# EAGLE design dilip (EAGLE 7.7.0)
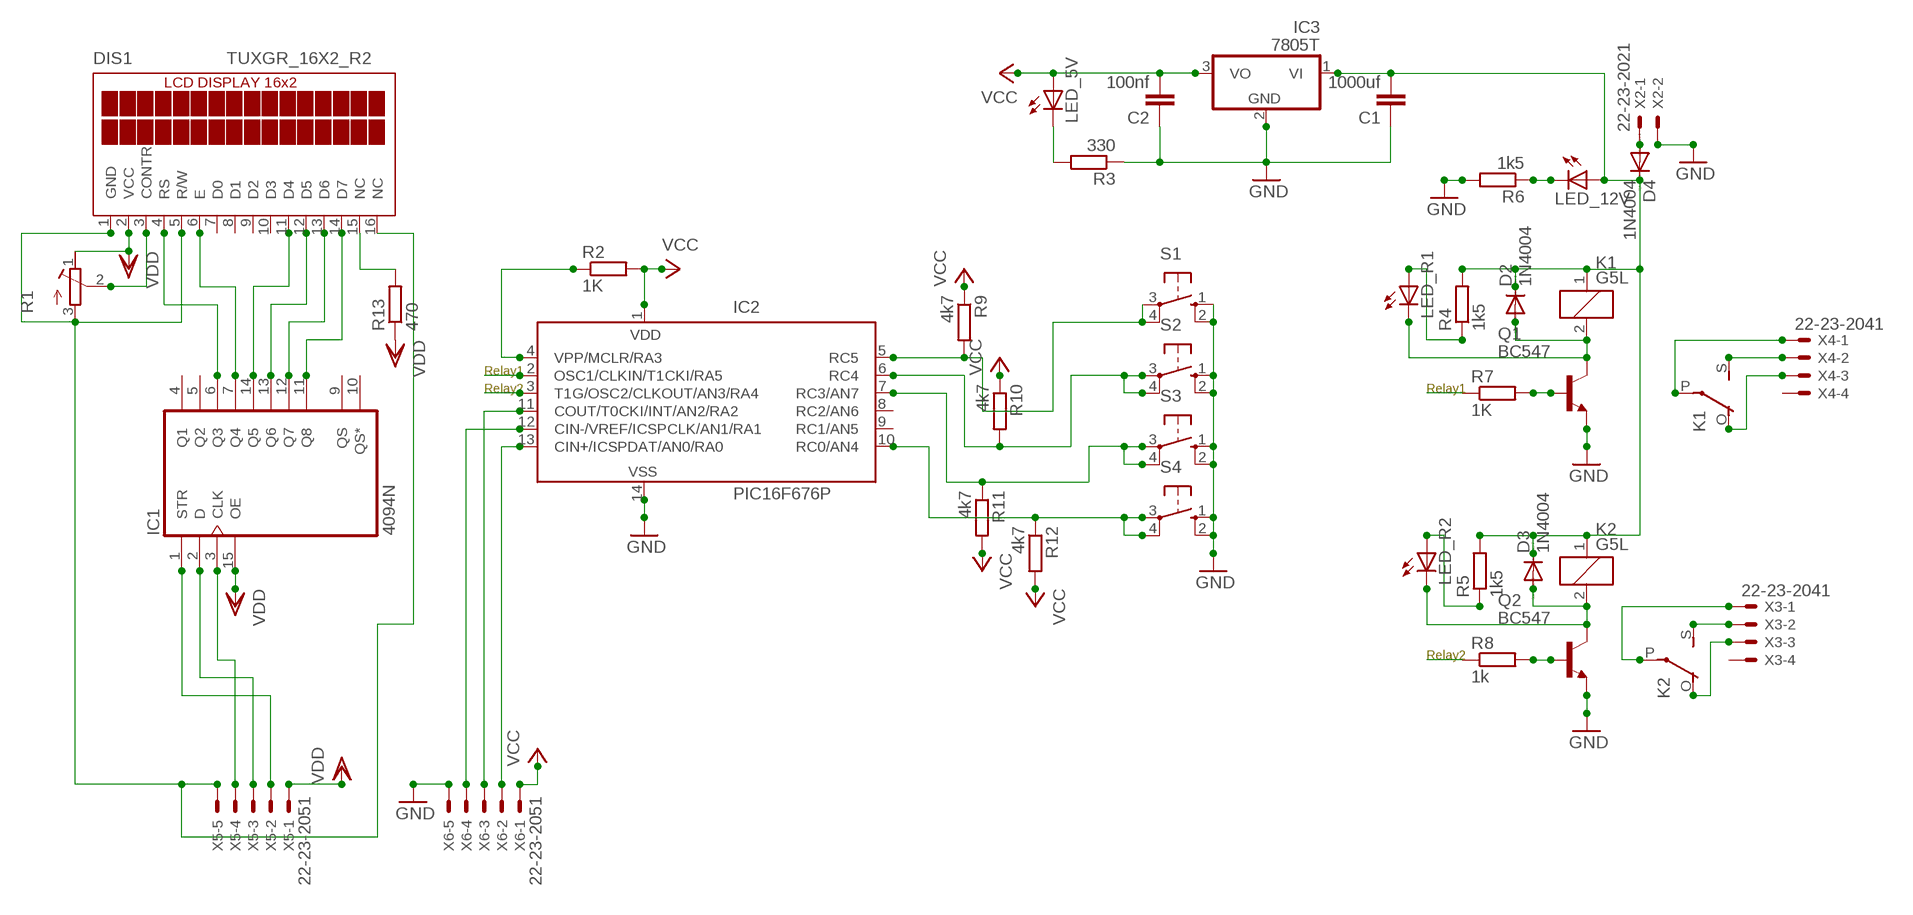
[diagram p0: schematic, sheet 1]

## Parts
C1  1000uf  C2.5/6  [C2.5-6]
C2  100nf  C2.5/6  [C2.5-6]
D2  1N4004  [DO41-10]
D3  1N4004  [DO41-10]
D4  1N4004  [DO41-10]
DIS1  TUXGR_16X2_R2  [TUXGR_16X2_R2]
IC1  4094N  [DIL16]
IC2  PIC16F676P  [DIL14]
IC3  7805T  [TO220H]
K1  G5L  [G5LE]
K2  G5L  [G5LE]
LED_5V  LED3MM  [LED3MM]
LED_12V  LED3MM  [LED3MM]
LED_R1  LED3MM  [LED3MM]
LED_R2  LED3MM  [LED3MM]
Q1  BC547  BC548  [TO92-EBC]
Q2  BC547  BC548  [TO92-EBC]
R1  R-TRIMMT93YA  [RTRIMT93YA]
R2  1K  R-EU_0207/10  [0207/10]
R3  330  R-EU_0207/10  [0207/10]
R4  1k5  R-EU_0207/10  [0207/10]
R5  1k5  R-EU_0207/10  [0207/10]
R6  1k5  R-EU_0207/10  [0207/10]
R7  1K  R-EU_0207/10  [0207/10]
R8  1k  R-EU_0207/10  [0207/10]
R9  4k7  R-EU_0207/10  [0207/10]
R10  4k7  R-EU_0207/10  [0207/10]
R11  4k7  R-EU_0207/10  [0207/10]
R12  4k7  R-EU_0207/10  [0207/10]
R13  470  R-EU_0207/10  [0207/10]
S1  40-XX  [B3F-40XX]
S2  40-XX  [B3F-40XX]
S3  40-XX  [B3F-40XX]
S4  40-XX  [B3F-40XX]
X2  22-23-2021  [22-23-2021]
X3  22-23-2041  [22-23-2041]
X4  22-23-2041  [22-23-2041]
X5  22-23-2051  [22-23-2051]
X6  22-23-2051  [22-23-2051]

## Nets
E: DIS1.6(E) IC1.7(Q4)
GND: C1.1 C2.1 IC2.14(VSS) IC3.2(GND) Q1.E Q2.E R3.1 R6.2 S1.1(S) S1.2(S1) S2.1(S) S2.2(S1) S3.1(S) S3.2(S1) S4.1(S) S4.2(S1) X2.2 X6.5
N$1: DIS1.3(CONTR) R1.2(S)
N$2: DIS1.11(D4) IC1.14(Q5)
N$3: DIS1.12(D5) IC1.13(Q6)
N$4: DIS1.13(D6) IC1.12(Q7)
N$5: DIS1.14(D7) IC1.11(Q8)
N$6: IC2.11(COUT/T0CKI/INT/AN2/RA2) X6.3
N$7: IC2.13(CIN+/ICSPDAT/AN0/RA0) X6.2
N$8: IC2.12(CIN-/VREF/ICSPCLK/AN1/RA1) X6.4
N$9: IC2.4(VPP/MCLR/RA3) R2.1
N$10: Q1.B R7.2
N$11: D2.A K1.2 LED_R1.K(C) Q1.C
N$12: D3.A K2.2 LED_R2.K(C) Q2.C
N$13: Q2.B R8.2
N$15: K2.P(2:P) X3.1
N$16: K2.S(2:S) X3.2
N$17: K2.O(2:O) X3.3
N$18: K1.S(2:S) X4.2
N$19: K1.P(2:P) X4.1
N$20: K1.O(2:O) X4.3
N$21: D4.A X2.1
N$22: LED_5V.K(C) R3.2
N$23: LED_R2.A R5.1
N$25: IC2.6(RC4) R10.2 S2.3(P) S2.4(P1)
N$26: LED_R1.A R4.1
N$27: IC2.7(RC3/AN7) R11.1 S3.3(P) S3.4(P1)
N$28: IC2.10(RC0/AN4) R12.1 S4.3(P) S4.4(P1)
N$30: LED_12V.K(C) R6.1
N$31: IC1.3(CLK) X5.4
N$32: IC1.2(D) X5.3
N$33: IC1.1(STR) X5.2
N$34: IC2.5(RC5) R9.2 S1.3(P) S1.4(P1)
N$35: DIS1.15(NC) R13.2
N$37: C1.2 D2.C D3.C D4.C IC3.1(VI) K1.1 K2.1 LED_12V.A R4.2 R5.2
RELAY1: IC2.2(OSC1/CLKIN/T1CKI/RA5) R7.1
RELAY2: IC2.3(T1G/OSC2/CLKOUT/AN3/RA4) R8.1
RS: DIS1.4(RS) IC1.6(Q3)
VCC: C2.2 IC2.1(VDD) IC3.3(VO) LED_5V.A R2.2 R9.1 R10.1 R11.2 R12.2 X6.1
VDD: DIS1.2(VCC) IC1.15(OE) R1.1(E) R13.1 X5.1
VSS: DIS1.1(GND) DIS1.5(R/W) DIS1.16(NC) R1.3(A) X5.5
Unconnected: DIS1.7(D0) DIS1.8(D1) DIS1.9(D2) DIS1.10(D3) IC1.4(Q1) IC1.5(Q2) IC1.9(QS) IC1.10(QS*) IC2.8(RC2/AN6) IC2.9(RC1/AN5) X3.4 X4.4

## Notes on the sheet
- Relay1
- Relay2 | Relay1
- Relay2

## Power pins joined to a net without a drawn wire
VDD: IC1.16(VDD)
VSS: IC1.8(VSS)

## Library data of the parts
C1 C2 = capacitor-wima:C: CAPACITOR naming: grid - package width
D2-D4 = diode:1N4004: DIODE general purpose rectifier, 1 A
DIS1 = display-lcd:TUXGR_16X2_R2: Tuxgraphics LCD display 16x2 characters reflective, without background light Source: tuxgr_12x2_r2.pdf; OC_FARNELL: unknown; OC_NEWARK: unknown
IC1 = 40xx:4094: 8-stage SHIFT/STORE REGISTER, tri-state
IC2 = microchip:PIC16F676: 14-Pin, Flash-Based 8-Bit CMOS Microcontroller High Performance RISC CPU: * Only 35 instructions to learn - All single-cycle instructions except branches * Operating speed: - DC - 20 MHz oscillator/clock input - DC - 200 ns instruction cycle * Internal and external oscillator options - Precision Internal 4 MHz oscillator factory calibrated to ±1% - External Oscillator support for crystals and resonators - 5?s wake-up from SLEEP, 3.0V, typical * Power saving SLEEP mode * Wide operating voltage range - 2.0V to 5.5V * Industrial and Extended temperature range * Low power Power-on Reset (POR) * Power-up Timer (PWRT) and Oscillator Start-up Timer (OST) * Brown-out Detect (BOD) * Watchdog Timer (WDT) with independent oscillator for reliable operation * Multiplexed MCLR/Input-pin * Interrupt-on-pin change * Individual programmable weak pull-ups * Programmable code protection * High Endurance FLASH/EEPROM Cell - 100,000 write FLASH endurance - 1,000,000 write EEPROM endurance - FLASH/Data EEPROM Retention: > 40 years * Standby Current: - 1 nA @ 2.0V, typical * Operating Current: - 8.5?A @ 32 kHz, 2.0V, typical - 100?A @ 1 MHz, 2.0V, typical * Watchdog Timer Current - 300 nA @ 2.0V, typical * Timer1 oscillator current: - 4?A @ 32 kHz, 2.0V, typical * 12 I/O pins with individual direction control * High current sink/source for direct LED drive * Analog-to-Digital Converter module (PIC16F676): - 10-bit resolution - Programmable 8-channel input - Voltage reference input * In-Circuit Serial ProgrammingTM (ICSPTM) via two pins Source: http://ww1.microchip.com/downloads/en/DeviceDoc/40039E.pdf; MF: MICROCHIP; MPN: PIC16F676-I/P; OC_FARNELL: 9760512; OC_NEWARK: 54K2829
IC3 = linear:78*: Positive VOLTAGE REGULATOR Source: http://cache.national.com/ds/LM/LM78L05.pdf http://www.fairchildsemi.com/ds/LM/LM7805.pdf
K1 K2 = relay:G5L: RELAY 1 x switch, 10 A/120 V AC, 8 A/30 V ADC, Omron; OC_FARNELL: unknown; OC_NEWARK: unknown
LED_5V LED_12V LED_R1 LED_R2 = led:LED: LED OSRAM: - CHIPLED LG R971, LG N971, LY N971, LG Q971, LY Q971, LO R971, LY R971 LH N974, LH R974 LS Q976, LO Q976, LY Q976 LO Q996 - Hyper CHIPLED LW Q18S LB Q993, LB Q99A, LB R99A - SideLED LS A670, LO A670, LY A670, LG A670, LP A670 LB A673, LV A673, LT A673, LW A673 LH A674 LY A675 LS A676, LA A676, LO A676, LY A676, LW A676 LS A679, LY A679, LG A679 - Hyper Micro SIDELED® LS Y876, LA Y876, LO Y876, LY Y876 LT Y87S - SmartLED LW L88C, LW L88S LB L89C, LB L89S, LG L890 LS L89K, LO L89K, LY L89K LS L896, LA L896, LO L896, LY L896 - TOPLED LS T670, LO T670, LY T670, LG T670, LP T670 LSG T670, LSP T670, LSY T670, LOP T670, LYG T670 LG T671, LOG T671, LSG T671 LB T673, LV T673, LT T673, LW T673 LH T674 LS T676, LA T676, LO T676, LY T676, LB T676, LH T676, LSB T676, LW T676 LB T67C, LV T67C, LT T67C, LS T67K, LO T67K, LY T67K, LW E67C LS E67B, LA E67B, LO E67B, LY E67B, LB E67C, LV E67C, LT E67C LW T67C LS T679, LY T679, LG T679 LS T770, LO T770, LY T770, LG T770, LP T770 LB T773, LV T773, LT T773, LW T773 LH T774 LS E675, LA E675, LY E675, LS T675 LS T776, LA T776, LO T776, LY T776, LB T776 LHGB T686 LT T68C, LB T68C - Hyper Mini TOPLED® LB M676 - Mini TOPLED Santana® LG M470 LS M47K, LO M47K, LY M47K Source: http://www.osram.convergy.de LUXEON: - LUMILED® LXK2-PW12-R00, LXK2-PW12-S00, LXK2-PW14-U00, LXK2-PW14-V00 LXK2-PM12-R00, LXK2-PM12-S00, LXK2-PM14-U00 LXK2-PE12-Q00, LXK2-PE12-R00, LXK2-PE12-S00, LXK2-PE14-T00, LXK2-PE14-U00 LXK2-PB12-K00, LXK2-PB12-L00, LXK2-PB12-M00, LXK2-PB14-N00, LXK2-PB14-P00, LXK2-PB14-Q00 LXK2-PR12-L00, LXK2-PR12-M00, LXK2-PR14-Q00, LXK2-PR14-R00 LXK2-PD12-Q00, LXK2-PD12-R00, LXK2-PD12-S00 LXK2-PH12-R00, LXK2-PH12-S00 LXK2-PL12-P00, LXK2-PL12-Q00, LXK2-PL12-R00 Source: www.luxeon.com KINGBRIGHT: KA-3528ASYC Source: www.kingbright.com
Q1 Q2 = transistor-npn:BC548*: NPN Transistor
R1 = rcl:R-TRIMM: Trimm resistor
R2-R13 = resistor:R-EU_: RESISTOR, European symbol
S1-S4 = switch-omron:40-XX: OMRON SWITCH; MF: OMRON COMPONENTS USA; MPN: B3F-4000; OC_FARNELL: 176434; OC_NEWARK: 36K3105
X2 = con-molex:22-23-2021: .100" (2.54mm) Center Header - 2 Pin; MF: MOLEX; MPN: 22-23-2021; OC_FARNELL: 1462926; OC_NEWARK: 25C3832
X3 X4 = con-molex:22-23-2041: .100" (2.54mm) Center Header - 4 Pin; MF: MOLEX; MPN: 22-23-2041; OC_FARNELL: 1462920; OC_NEWARK: 38C0355
X5 X6 = con-molex:22-23-2051: .100" (2.54mm) Center Header - 5 Pin; MF: MOLEX; MPN: 22-23-2051; OC_FARNELL: 1462952; OC_NEWARK: 38C9178

## Board
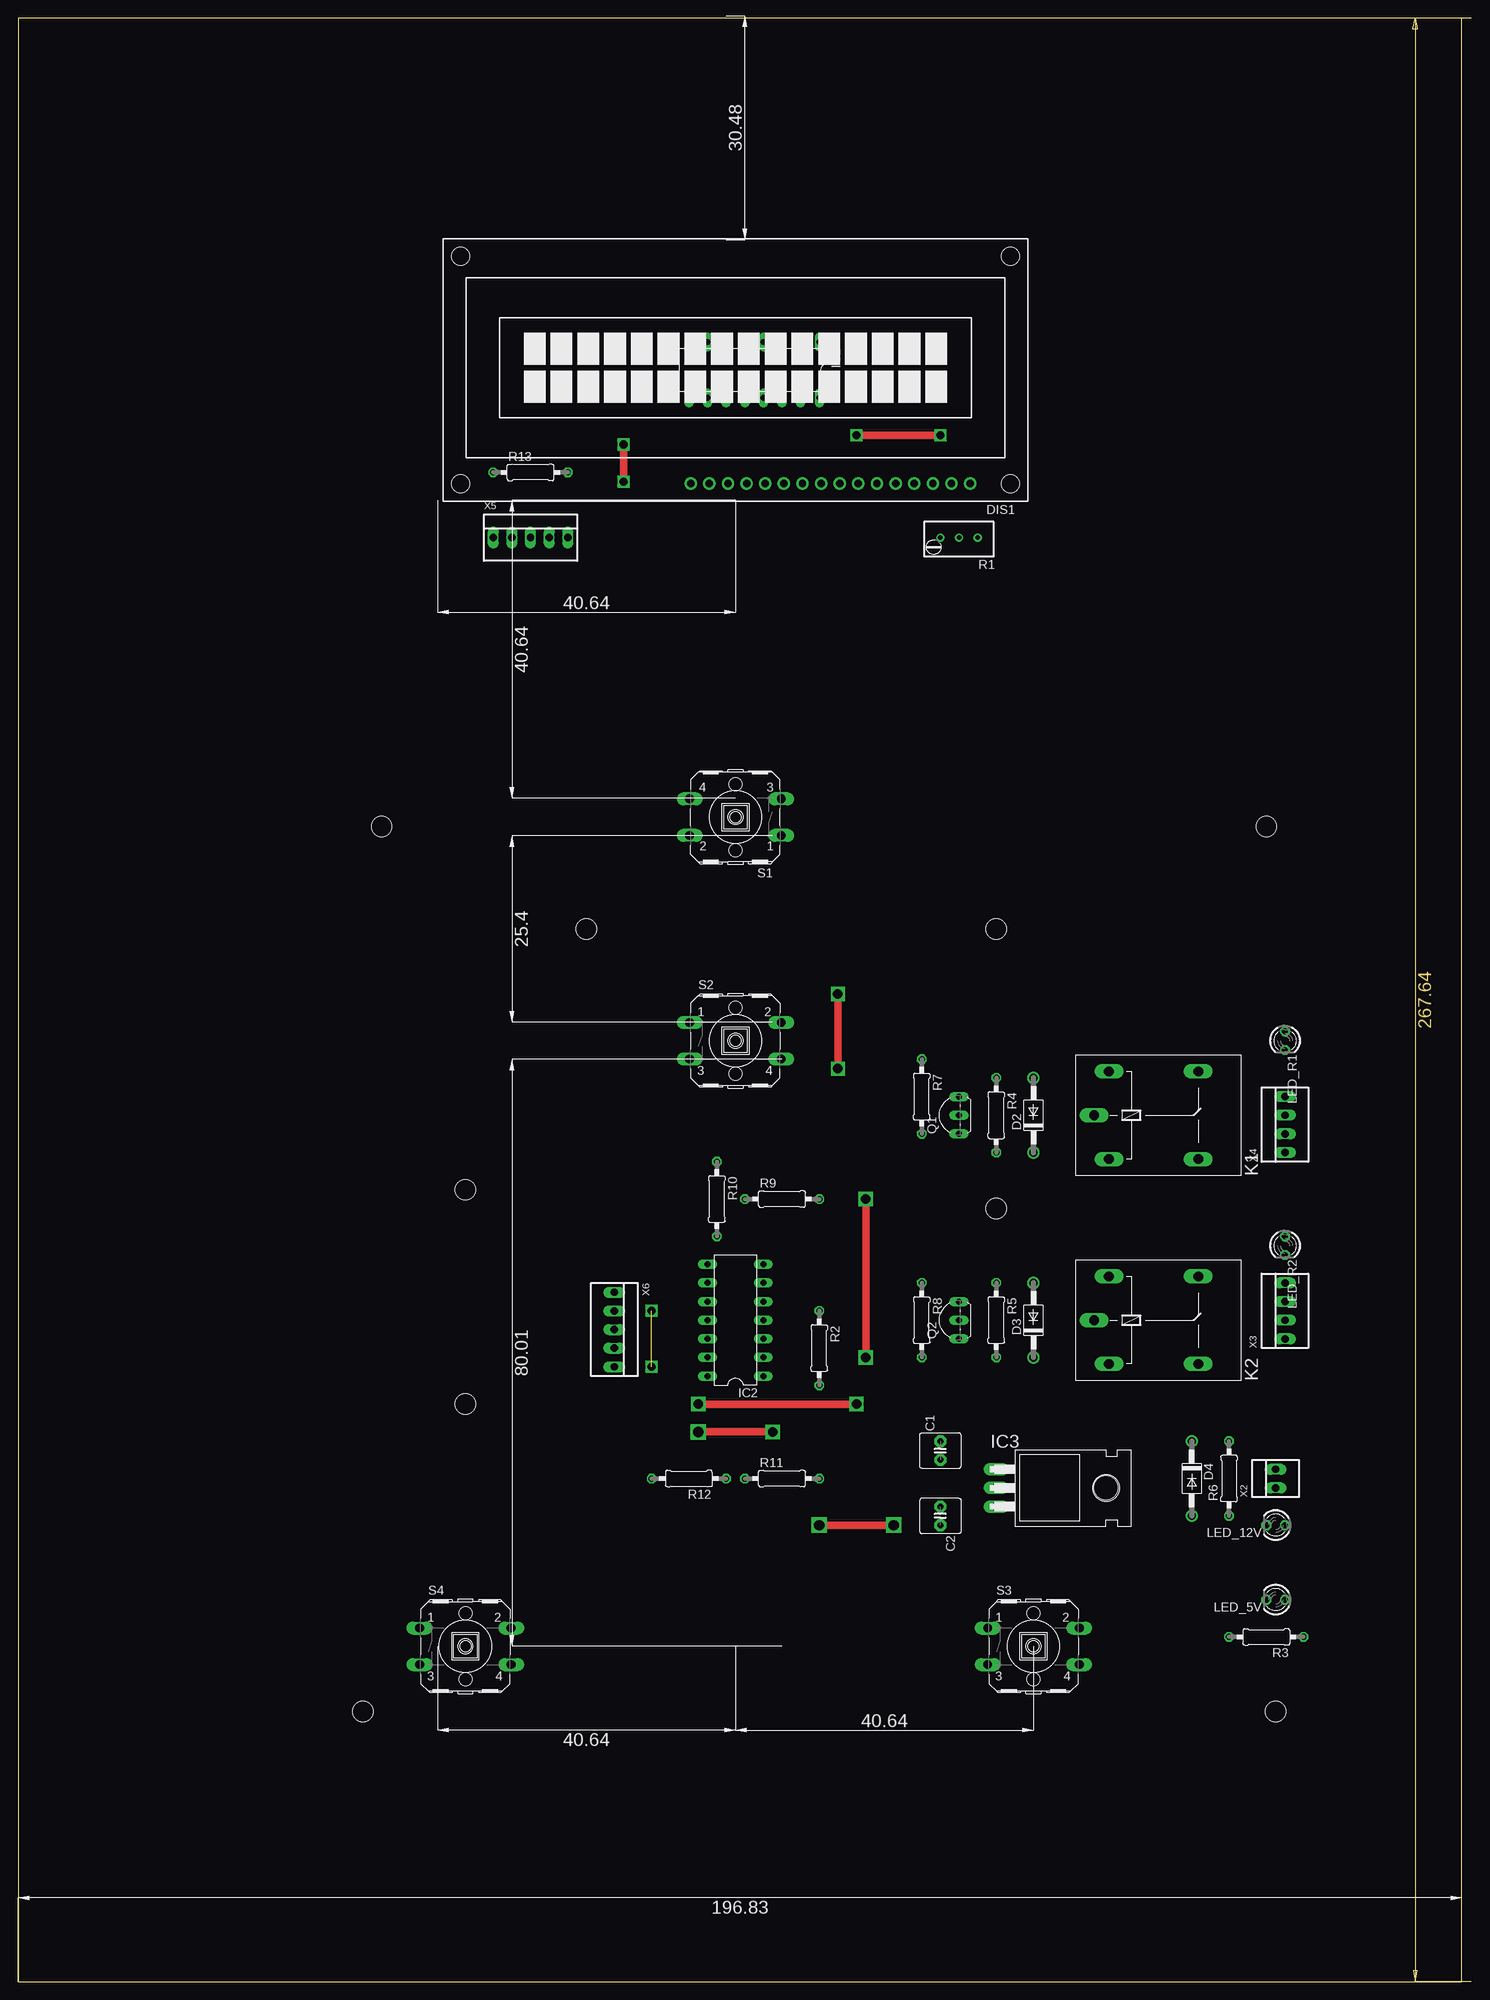
[diagram p1: board, top side]
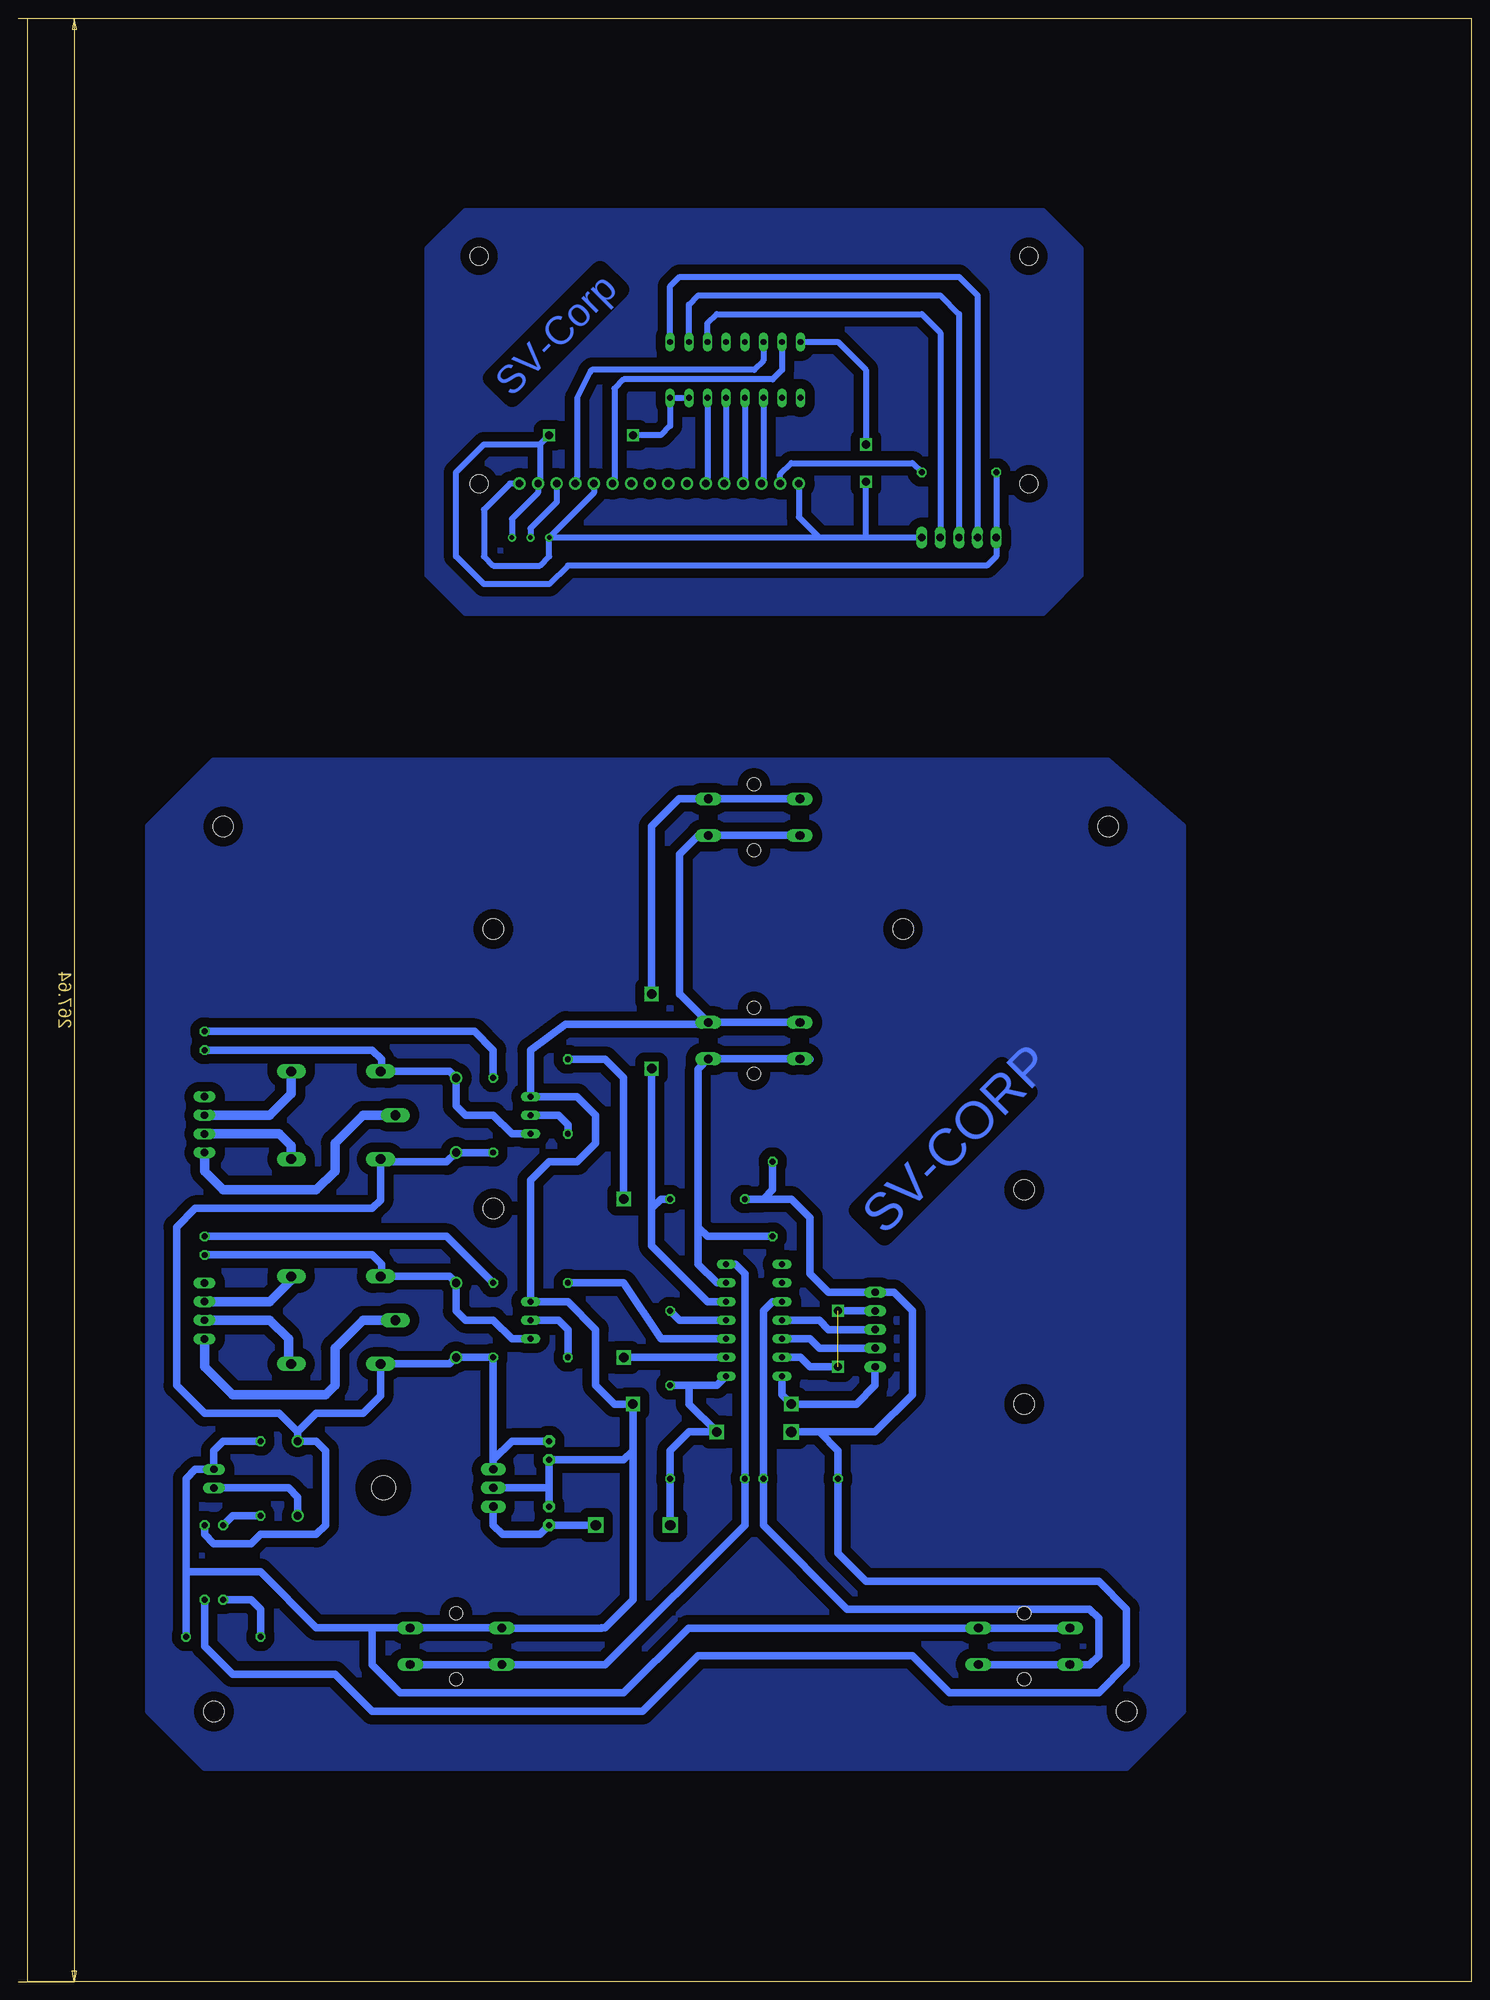
[diagram p2: board, bottom side, seen from below]

Size 196.83 x 267.64 mm. Coordinates in mm from the lower left corner, seen from the top.
Outline: 0,0 196.83,0 196.83,267.64 0,267.64 0,0
Copper layers (1*16): Top 0.035mm / dielectric 1.5mm / Bottom 0.035mm
Design rules "default": minimum track width 10mil, minimum drill 24mil, track to track 8mil, track to pad 8mil, pad to pad 8mil, via to via 8mil, smd to smd 8mil, copper to edge 40mil, drill to drill 8mil, minimum pad ring 10mil, minimum via ring 8mil, stop-mask expansion 4mil, vias tented up to drill 0mil, thermal gap 10mil
Holes 2.8 mm at 46.99,36.83 171.45,36.83 49.53,157.48 170.18,157.48 133.35,143.51 77.47,143.51 60.96,107.95 133.35,105.41 60.96,78.74

### Footprints (pad centres in the part's own frame; a part is rotated, then mirrored left to right if it is on the bottom)
C2.5-6 = drill 0.813 pad 1.6 octagon: 1 -1.27,0; 2 1.27,0
DO41-10 = drill 1.118: A 5.08,0; C -5.08,0
TUXGR_16X2_R2 = drill 1 pad 1.676: 1 -32,15.5; 2 -29.46,15.5; 3 -26.92,15.5; 4 -24.38,15.5; 5 -21.84,15.5; 6 -19.3,15.5; 7 -16.76,15.5; 8 -14.22,15.5; 9 -11.68,15.5; 10 -9.14,15.5; 11 -6.6,15.5; 12 -4.06,15.5; 13 -1.52,15.5; 14 1.02,15.5; 15 3.56,15.5; 16 6.1,15.5 | hole 2.5: -37.5,-15.5; 37.5,-15.5; -37.5,15.5; 37.5,15.5
DIL16 = drill 0.813 long: 1 -8.89,-3.81; 2 -6.35,-3.81; 3 -3.81,-3.81; 4 -1.27,-3.81; 5 1.27,-3.81; 6 3.81,-3.81; 7 6.35,-3.81; 8 8.89,-3.81; 9 8.89,3.81; 10 6.35,3.81; 11 3.81,3.81; 12 1.27,3.81; 13 -1.27,3.81; 14 -3.81,3.81; 15 -6.35,3.81; 16 -8.89,3.81
DIL14 = drill 0.813 long: 1 -7.62,-3.81; 2 -5.08,-3.81; 3 -2.54,-3.81; 4 0,-3.81; 5 2.54,-3.81; 6 5.08,-3.81; 7 7.62,-3.81; 8 7.62,3.81; 9 5.08,3.81; 10 2.54,3.81; 11 0,3.81; 12 -2.54,3.81; 13 -5.08,3.81; 14 -7.62,3.81
TO220H = drill 1.118 long: 1 -2.54,-10.16; 2 0,-10.16; 3 2.54,-10.16 | hole 3.302: 0,4.826
G5LE = drill 1.321 long: 1 -7.493,-5.969; 2 -7.493,5.969; O 4.699,5.969; P -9.525,0; S 4.699,-5.969
LED3MM = drill 0.813 octagon: A -1.27,0; K 1.27,0
TO92-EBC = drill 0.813 long: B 0,-1.27; C -2.54,-1.27; E 2.54,-1.27
RTRIMT93YA = drill 0.61: 1 0,-2.54; 2 0,0; 3 0,2.54
0207/10 = drill 0.813 octagon: 1 -5.08,0; 2 5.08,0
B3F-40XX = drill 1.194 long: 1 -6.248,2.489; 2 6.248,2.489; 3 -6.248,-2.489; 4 6.248,-2.489 | hole 1.803: 0,-4.496; 0,4.496
22-23-2021 = drill 1 long: 1 -1.27,0; 2 1.27,0
22-23-2041 = drill 1 long: 1 -3.81,0; 2 -1.27,0; 3 1.27,0; 4 3.81,0
22-23-2051 = drill 1 long: 1 -5.08,0; 2 -2.54,0; 3 0,0; 4 2.54,0; 5 5.08,0

### Placement (x,y rotation side)
C1  125.73,72.39 90 top
C2  125.73,63.5 270 top
D2  138.43,118.11 90 top
D3  138.43,90.17 90 top
D4  160.02,68.58 270 top
DIS1  97.79,219.71 180 top
IC1  100.33,219.71 180 top
IC2  97.79,90.17 90 top
IC3  143.51,67.31 270 top
K1  156.21,118.11 0 top
K2  156.21,90.17 0 top
LED_5V  171.45,52.07 180 top
LED_12V  171.45,62.23 180 top
LED_R1  172.72,128.27 270 top
LED_R2  172.72,100.33 270 top
Q1  127,118.11 90 top
Q2  127,90.17 90 top
R1  128.27,196.85 90 top
R2  109.22,86.36 270 top
R3  170.18,46.99 180 top
R4  133.35,118.11 270 top
R5  133.35,90.17 270 top
R6  165.1,68.58 90 top
R7  123.19,120.65 270 top
R8  123.19,90.17 270 top
R9  104.14,106.68 0 top
R10  95.25,106.68 270 top
R11  104.14,68.58 0 top
R12  91.44,68.58 180 top
R13  69.85,205.74 0 top
S1  97.79,158.75 180 top
S2  97.79,128.27 0 top
S3  138.43,45.72 0 top
S4  60.96,45.72 0 top
X2  171.45,68.58 90 top
X3  172.72,91.44 90 top
X4  172.72,116.84 90 top
X5  69.85,196.85 0 top
X6  81.28,88.9 270 top

### Tracks (layer width: path | path; a pad name or v marks a point on that pad's centre or on a via)
E
  Bottom 0.813: IC1.7 93.98,219.71 95.25,218.44 115.57,218.44 116.84,217.17 116.84,204.46 DIS1.6
GND  (via drill 1.3)
  Top 1.016: v114.3,78.74 v92.71,78.74
  Bottom 1.016: X6.5 81.28,81.28 83.82,78.74 v92.71,78.74 93.98,80.01 IC2.14 | R3.1 175.26,55.88 | 175.26,55.88 175.26,68.58 173.99,69.85 X2.2 171.45,72.39 170.18,73.66 R6.2 | 114.3,72.39 114.3,52.07 118.11,48.26 118.57,48.26 118.62,48.21 S3.1 132.23,48.26 144.73,48.26 | 114.3,72.39 v114.3,78.74 116.84,78.74 119.38,81.28 119.38,88.9 123.19,92.71 Q2.E 128.27,109.22 125.73,111.76 121.92,111.76 119.38,114.3 119.38,118.11 121.92,120.65 Q1.E 128.27,127 123.47,130.53 104.27,130.53 S2.2 | S1.2 S1.1 105.36,156.26 107.95,153.67 107.95,134.62 107.9,134.62 S2.2 | S2.2 S2.1 | 144.73,48.26 S3.2 | 149.86,48.26 149.86,43.18 146.05,39.37 115.57,39.37 106.73,48.21 S4.2 S4.1 | 144.73,48.26 149.86,48.26 | 125.73,67.31 C1.1 115.57,71.12 114.3,72.39 | 125.73,67.31 C2.1 | IC3.2 125.73,67.31 | 149.86,48.26 157.48,48.26 165.1,55.88 175.26,55.88
N$1
  Bottom 0.813: DIS1.3 124.71,201.68 128.27,198.12 R1.2
N$2
  Bottom 0.813: IC1.14 104.14,204.46 DIS1.11
N$3
  Bottom 0.813: IC1.13 101.6,204.46 DIS1.12
N$4
  Bottom 0.813: IC1.12 99.06,204.46 DIS1.13
N$5
  Bottom 0.813: IC1.11 96.52,204.46 DIS1.14
N$6
  Bottom 1.016: X6.3 87.63,88.9 88.9,90.17 IC2.11
N$7  (via drill 1.1)  (1 unrouted)
  Bottom 1.016: X6.2 v86.36,91.44 | IC2.13 91.44,85.09 90.17,83.82 v86.36,83.82
N$8
  Bottom 1.016: X6.4 88.9,86.36 90.17,87.63 IC2.12
N$9
  Bottom 1.016: IC2.4 107.95,90.17 R2.1
N$10
  Bottom 1.016: Q1.B 124.46,118.11 123.19,116.84 R7.2
N$11
  Bottom 1.016: Q1.C 130.81,115.57 133.35,118.11 137.16,118.11 138.43,119.38 D2.A 139.32,124.08 K1.2 148.59,124.21 148.59,125.73 149.86,127 LED_R1.K
N$12
  Bottom 1.016: Q2.C 130.81,87.63 133.35,90.17 137.16,90.17 138.43,91.44 D3.A 139.32,96.14 K2.2 148.59,96.27 148.59,97.79 149.86,99.06 LED_R2.K
N$13
  Bottom 1.016: Q2.B 124.46,90.17 123.19,88.9 R8.2
N$14
  pour Bottom (isolate 1.27): 58.42,241.3 137.16,241.3 142.24,236.22 142.24,191.77 137.16,186.69 58.42,186.69 53.34,191.77 53.34,236.22
N$15
  Bottom 1.27: K2.P 151.13,90.17 154.94,86.36 154.94,81.28 156.21,80.01 168.91,80.01 172.72,83.82 X3.1
N$16
  Bottom 1.27: X3.2 163.83,90.17 161.29,87.63 161.29,84.58 K2.S
N$17
  Bottom 1.27: K2.O 160.91,95.63 163.83,92.71 X3.3
N$18
  Bottom 1.27: K1.S 160.91,113.92 162.56,115.57 X4.2
N$19
  Bottom 1.27: K1.P 151.13,118.11 154.94,114.3 154.94,110.49 157.48,107.95 170.18,107.95 172.72,110.49 X4.1
N$20
  Bottom 1.27: X4.3 163.83,118.11 160.91,121.03 K1.O
N$21
  Bottom 1.016: X2.1 161.29,67.31 160.02,66.04 D4.A
N$22
  Bottom 1.016: LED_5V.K 166.37,52.07 165.1,50.8 R3.2
N$23
  Bottom 1.016: R5.1 139.7,101.6 LED_R2.A
N$24
  pour Bottom (isolate 1.27): 49.53,166.37 171.45,166.37 180.34,157.48 180.34,36.83 172.72,29.21 46.99,29.21 39.37,36.83 39.37,157.48
N$25
  Bottom 1.016: IC2.6 102.87,95.25 105.41,97.79 105.41,102.87 | 105.41,102.87 105.41,124.41 S2.4 S2.3 91.49,125.73 90.17,125.73 | R10.2 104.14,101.6 105.41,102.87
N$26
  Bottom 1.016: R4.1 133.35,127 135.89,129.54 LED_R1.A
N$27
  Bottom 1.016: IC2.7 100.33,97.79 99.06,96.52 R11.1 99.06,62.23 118.11,43.18 132.13,43.18 S3.3 S3.4
N$28
  Bottom 1.016: IC2.10 95.25,92.71 96.52,91.44 R12.1 96.52,62.23 85.09,50.8 52.07,50.8 50.8,49.53 50.8,44.45 52.07,43.18 54.66,43.18 S4.3 | S4.3 54.66,43.23 | S4.3 S4.4
N$30
  Bottom 1.016: LED_12V.K 168.91,63.5 R6.1
N$31
  Bottom 0.813: IC1.3 104.14,226.06 102.87,227.33 74.93,227.33 72.39,224.79 X5.4
N$32
  Bottom 0.813: IC1.2 106.68,228.6 105.41,229.87 72.39,229.87 69.85,227.33 X5.3
N$33
  Bottom 0.813: IC1.1 109.22,231.14 107.95,232.41 69.85,232.41 67.31,229.87 X5.2
N$34  (via drill 1.1, 1.3)
  Top 1.016: v111.76,134.62 v111.76,124.46
  Bottom 0.813: 91.49,161.29 S1.4
  Bottom 1.016: IC2.5 104.14,92.71 111.76,100.33 111.76,105.41 | 111.76,105.41 v111.76,124.46 | v111.76,134.62 111.76,157.48 108,161.24 S1.3 S1.4 | R9.2 110.49,106.68 111.76,105.41
N$35
  Bottom 0.813: DIS1.15 94.23,205.49 92.71,207.01 76.2,207.01 R13.2
N$37
  Bottom 1.016: R4.2 D2.C 139.7,111.76 148.34,111.76 K1.1 148.72,106.55 149.86,105.41 173.99,105.41 176.53,102.87 176.53,81.28 172.72,77.47 162.56,77.47 160.02,74.93 | 160.02,74.93 D4.C 157.48,73.66 156.21,72.39 156.21,62.23 157.48,60.96 165.1,60.96 166.37,59.69 171.45,59.69 172.72,60.96 LED_12V.A | 160.02,74.93 157.48,77.47 151.13,77.47 148.72,79.88 K2.1 139.32,84.2 D3.C R5.2 133.35,71.12 | 133.35,71.12 IC3.1 | C1.2 130.81,73.66 133.35,71.12
RELAY1  (via drill 1.3)
  Top 1.016: v115.57,106.68 v115.57,85.09
  Bottom 1.016: R7.1 118.11,125.73 115.57,123.19 v115.57,106.68 | IC2.2 v115.57,85.09
RELAY2
  Bottom 1.016: R8.1 115.57,95.25 110.49,87.63 IC2.3
RS
  Bottom 0.813: IC1.6 96.52,220.98 97.79,219.71 119.89,219.71 120.14,219.46 121.92,215.9 121.92,205.23 DIS1.4
VCC  (via drill 1.3, 1.4, 1.4 pad 1.27)
  Top 1.016: v92.71,74.93 v102.87,74.93 | v109.22,62.23 v119.38,62.23
  Bottom 1.016: 88.9,74.93 81.28,74.93 76.2,80.01 76.2,91.44 78.74,93.98 X6.1 87.63,93.98 90.17,96.52 90.17,104.14 92.71,106.68 96.52,106.68 | 88.9,74.93 v92.71,74.93 | IC2.1 102.87,81.28 106.68,81.28 | 106.68,81.28 R2.2 | 106.68,81.28 106.68,78.74 v102.87,74.93 106.68,74.93 109.22,72.39 R11.2 v109.22,62.23 | 88.9,74.93 86.36,72.39 R12.2 86.36,58.42 82.55,54.61 50.8,54.61 46.99,50.8 46.99,43.18 50.8,39.37 71.12,39.37 76.2,44.45 105.41,44.45 113.03,36.83 149.86,36.83 154.94,41.91 168.91,41.91 172.72,45.72 LED_5V.A | R9.1 96.52,106.68 | 96.52,106.68 95.25,107.95 R10.1 | IC3.3 133.35,62.23 132.08,60.96 127,60.96 C2.2 v119.38,62.23
VDD  (via drill 1.1)
  Top 1.016: v114.3,210.82 v125.73,210.82
  Bottom 0.813: IC1.15 IC1.16 109.22,212.09 110.49,210.82 v114.3,210.82 | R1.1 130.81,199.39 127.25,202.95 DIS1.2 127,204.46 127,209.55 | 127,209.55 v125.73,210.82 | 127,209.55 134.62,209.55 138.43,205.74 138.43,194.31 134.62,190.5 125.73,190.5 123.19,193.04 66.04,193.04 64.77,194.31 X5.1 R13.1
VSS  (via drill 1.1)
  Top 1.016: v82.55,209.55 v82.55,204.47
  Bottom 0.813: IC1.8 86.36,223.52 82.55,219.71 v82.55,209.55 | DIS1.1 131.07,204.21 134.62,200.66 134.62,194.31 133.35,193.04 127,193.04 125.73,194.31 R1.3 | DIS1.5 119.63,202.95 R1.3 | X5.5 82.55,196.85 | 82.55,196.85 88.9,196.85 | 88.9,196.85 R1.3 | DIS1.16 91.69,199.64 88.9,196.85 | 82.55,196.85 v82.55,204.47

### Text on the board
Bottom: SV-Corp | SV-CORP